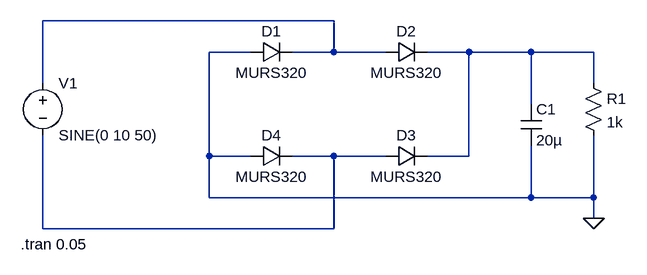
[diagram p0: schematic Draft4.asc]
Draft4.asc, the LTspice schematic file:
Version 4
SHEET 1 1048 680
WIRE 592 0 144 0
WIRE 464 48 400 48
WIRE 592 48 592 0
WIRE 592 48 528 48
WIRE 672 48 592 48
WIRE 800 48 736 48
WIRE 896 48 800 48
WIRE 992 48 896 48
WIRE 144 96 144 0
WIRE 992 96 992 48
WIRE 896 128 896 48
WIRE 400 208 400 48
WIRE 464 208 400 208
WIRE 592 208 528 208
WIRE 672 208 592 208
WIRE 800 208 800 48
WIRE 800 208 736 208
WIRE 400 272 400 208
WIRE 896 272 896 192
WIRE 896 272 400 272
WIRE 992 272 992 176
WIRE 992 272 896 272
WIRE 992 304 992 272
WIRE 144 320 144 176
WIRE 592 320 592 208
WIRE 592 320 144 320
FLAG 992 304 0
SYMBOL voltage 144 80 R0
WINDOW 123 0 0 Left 0
WINDOW 39 0 0 Left 0
SYMATTR InstName V1
SYMATTR Value SINE(0 10 50)
SYMBOL diode 464 64 R270
WINDOW 0 32 32 VTop 2
WINDOW 3 0 32 VBottom 2
SYMATTR InstName D1
SYMATTR Value MURS320
SYMBOL res 976 80 R0
SYMATTR InstName R1
SYMATTR Value 1k
SYMBOL diode 672 64 R270
WINDOW 0 32 32 VTop 2
WINDOW 3 0 32 VBottom 2
SYMATTR InstName D2
SYMATTR Value MURS320
SYMBOL diode 672 224 R270
WINDOW 0 32 32 VTop 2
WINDOW 3 0 32 VBottom 2
SYMATTR InstName D3
SYMATTR Value MURS320
SYMBOL diode 464 224 R270
WINDOW 0 32 32 VTop 2
WINDOW 3 0 32 VBottom 2
SYMATTR InstName D4
SYMATTR Value MURS320
SYMBOL cap 880 128 R0
SYMATTR InstName C1
SYMATTR Value 20µ
TEXT 110 344 Left 2 !.tran 0.05

The netlist it stands for:
* Draft4.asc
V1 N001 N003 SINE(0 10 50)
D1 0 N001 MURS320
R1 N002 0 1k
D2 N001 N002 MURS320
D3 N003 N002 MURS320
D4 0 N003 MURS320
C1 N002 0 20µ
.model D D
.lib standard.dio
.tran 0.05
.backanno
.end